# Altium schematic sheet 04_Sensor.SchDoc
size A4
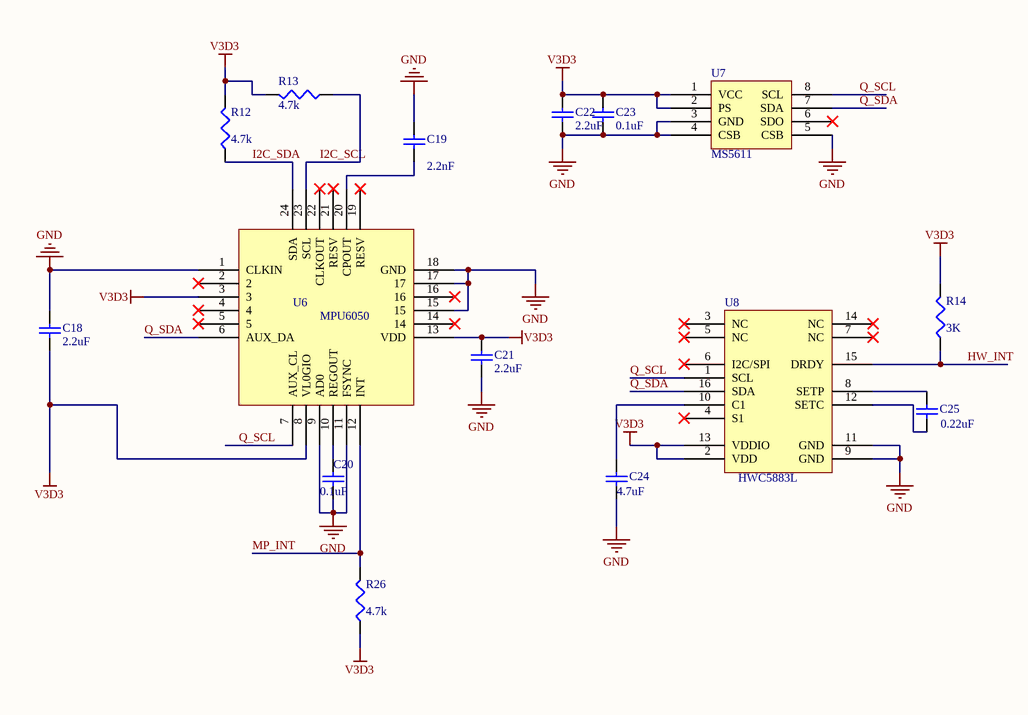
[diagram p0: 04_Sensor.SchDoc]

## Parts
C18  value 2.2uF  [0402]  (hidden comment: Cap)
C19  value 2.2nF  [0402]  (hidden comment: Cap)
C20  value 0.1uF  [0402]  (hidden comment: Cap)
C21  value 2.2uF  [0402]  (hidden comment: Cap)
C22  value 2.2uF  [0402]  (hidden comment: Cap)
C23  value 0.1uF  [0402]  (hidden comment: Cap)
C24  value 4.7uF  [0402]  (hidden comment: Cap)
C25  value 0.22uF  [0402]  (hidden comment: Cap)
R12  value 4.7k  [0402]  (hidden comment: Res3)
R13  value 4.7k  [0402]  (hidden comment: Res3)
R14  value 3K  [0402]  (hidden comment: Res3)
R26  value 4.7k  [0402]  (hidden comment: Res3)
U6  MPU6050  [QFN24]
U7  MS5611  [MS5611 - duplicate]
U8  HWC5883L  [HMC5883L]

## Nets
GND: C18.2 C19.2 C20.1 C21.1 C22.1 C23.1 C24.1 U6.1(CLKIN) U6.9(AD0) U6.11(FSYNC) U6.15 U6.17 U6.18(GND) U7.3(GND) U7.4(CSB) U7.5(CSB) U8.9(GND) U8.11(GND)
V3D3: C18.1 C21.2 C22.2 C23.2 R12.2 R13.2 R14.2 R26.1 U6.3 U6.8(VL0GIO) U6.13(VDD) U7.1(VCC) U7.2(PS) U8.2(VDD) U8.13(VDDIO)
HW_INT: R14.1 U8.15(DRDY)
I2C_SCL: R13.1 U6.23(SCL)
I2C_SDA: R12.1 U6.24(SDA)
MP_INT: R26.2 U6.12(INT)
Q_SCL: U6.7(AUX_CL) U7.8(SCL) U8.1(SCL)
Q_SDA: U6.6(AUX_DA) U7.7(SDA) U8.16(SDA)
NetC19_1: C19.1 U6.20(CPOUT)
NetC20_2: C20.2 U6.10(REGOUT)
NetC24_2: C24.2 U8.10(C1)
NetC25_1: C25.1 U8.12(SETC)
NetC25_2: C25.2 U8.8(SETP)

Not connected (* = marked no-connect by the designer): U6 2* 4* 5* 14* 16* 19(RESV)* 21(RESV)* 22(CLKOUT)*; U7 6(SDO)*; U8 3(NC)* 4(S1)* 5(NC)* 6(I2C/SPI)* 7(NC)* 14(NC)*

## Library data of the parts
C18-C25 = Cap: Capacitor; Published: 8-Jun-2000; LatestRevisionDate: 17-Jul-2002; LatestRevisionNote: Re-released for DXP Platform.; PackageReference: RAD-0.3; Publisher: Altium Limited; PackageDescription: Radial Cap, Thru-Hole; 2 Leads; 0.3 in Pin Spacing
R12-R14 R26 = Res3: Resistor; Published: 8-Jun-2000; LatestRevisionDate: 29-May-2009; LatestRevisionNote: IPC-7351 Footprint Added.; PackageReference: J1-0603; Publisher: Altium Limited; PackageDescription: Chip Resistor
U8 = HMC5883L